# Altium schematic sheet Level_Shifter.SchDoc
size A4; CompanyName: Technische Hochschule Nürnberg Georg Simon Ohm; Organization: UltraZohm; Address1: Kesslerplatz 12; Address2: 90489 Nürnberg; Address3: GERMANY; DocumentNumber: 4; SheetNumber: 4; SheetTotal: 5; Website: www.ultrazohm.com
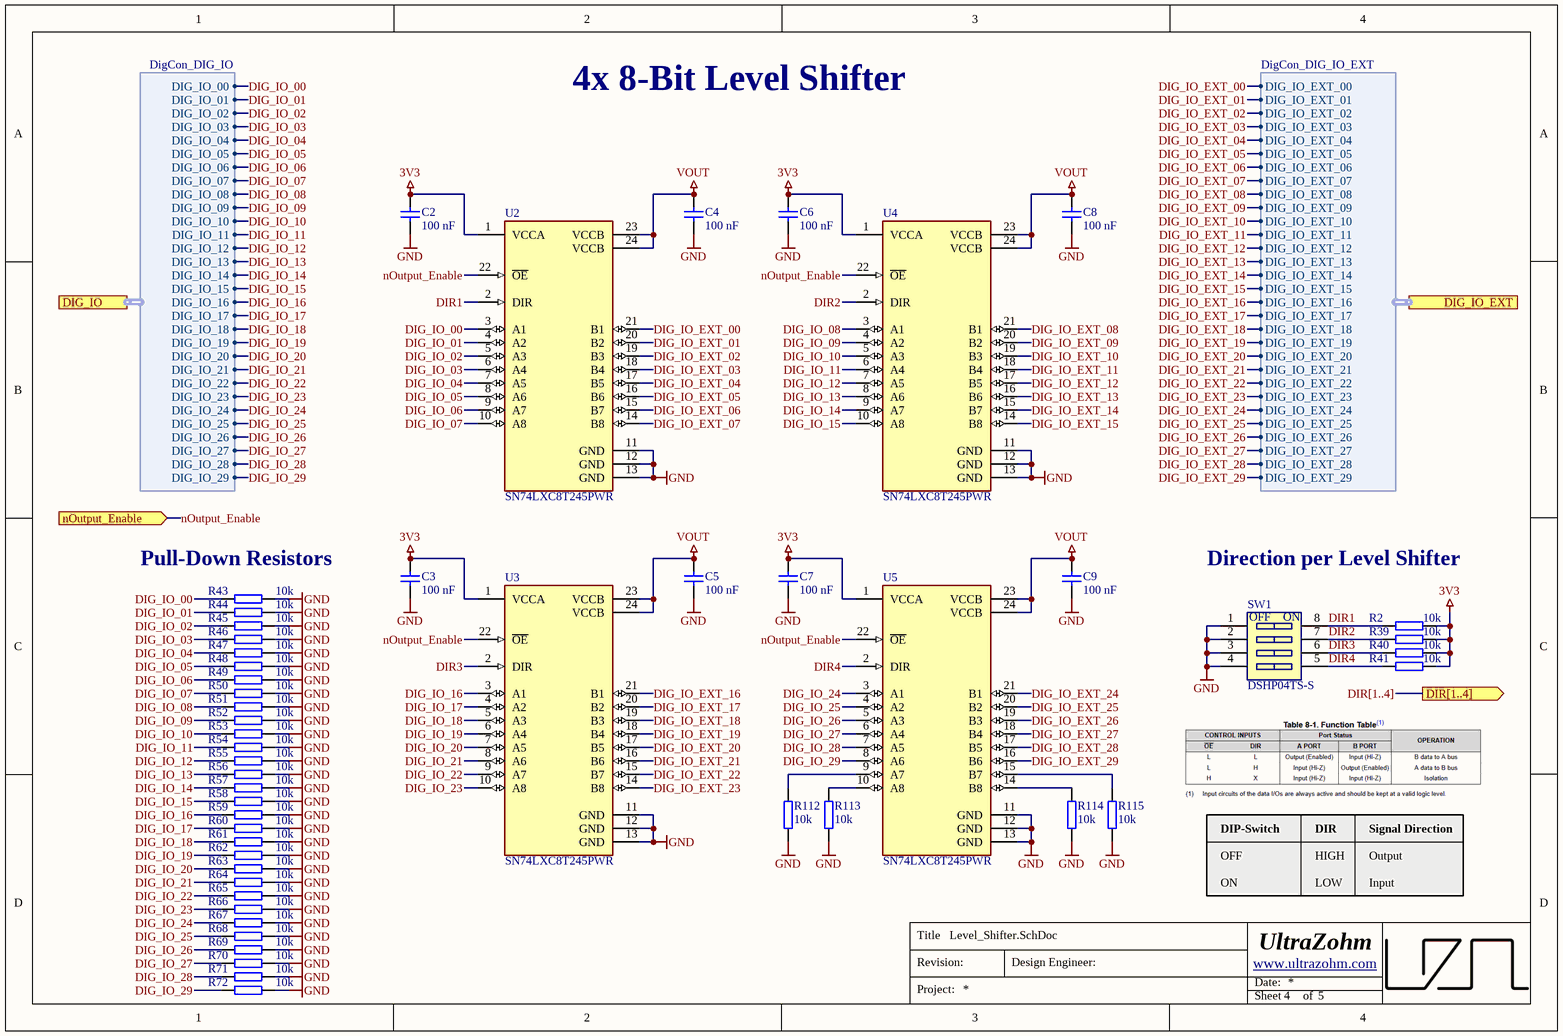
[diagram p0: Level_Shifter.SchDoc]

## Parts
C2  100 nF  [C_0603_TE]
C3  100 nF  [C_0603_TE]
C4  100 nF  [C_0603_TE]
C5  100 nF  [C_0603_TE]
C6  100 nF  [C_0603_TE]
C7  100 nF  [C_0603_TE]
C8  100 nF  [C_0603_TE]
C9  100 nF  [C_0603_TE]
R2  10k  [R_0603_TE]
R39  10k  [R_0603_TE]
R40  10k  [R_0603_TE]
R41  10k  [R_0603_TE]
R43  10k  [R_0603_TE]
R44  10k  [R_0603_TE]
R45  10k  [R_0603_TE]
R46  10k  [R_0603_TE]
R47  10k  [R_0603_TE]
R48  10k  [R_0603_TE]
R49  10k  [R_0603_TE]
R50  10k  [R_0603_TE]
R51  10k  [R_0603_TE]
R52  10k  [R_0603_TE]
R53  10k  [R_0603_TE]
R54  10k  [R_0603_TE]
R55  10k  [R_0603_TE]
R56  10k  [R_0603_TE]
R57  10k  [R_0603_TE]
R58  10k  [R_0603_TE]
R59  10k  [R_0603_TE]
R60  10k  [R_0603_TE]
R61  10k  [R_0603_TE]
R62  10k  [R_0603_TE]
R63  10k  [R_0603_TE]
R64  10k  [R_0603_TE]
R65  10k  [R_0603_TE]
R66  10k  [R_0603_TE]
R67  10k  [R_0603_TE]
R68  10k  [R_0603_TE]
R69  10k  [R_0603_TE]
R70  10k  [R_0603_TE]
R71  10k  [R_0603_TE]
R72  10k  [R_0603_TE]
R112  10k  [R_0603_TE]
R113  10k  [R_0603_TE]
R114  10k  [R_0603_TE]
R115  10k  [R_0603_TE]
SW1  DSHP04TS-S  [416131160804]
U2  SN74LXC8T245PWR  [TSSOP-24]
U3  SN74LXC8T245PWR  [TSSOP-24]
U4  SN74LXC8T245PWR  [TSSOP-24]
U5  SN74LXC8T245PWR  [TSSOP-24]

## Ports
DIG_IO (harness DigCon_DIG_IO), DIG_IO_EXT (harness DigCon_DIG_IO_EXT), DIR[1..4] (out), nOutput_Enable (in)

## Harnesses
DigCon_DIG_IO: DIG_IO_01, DIG_IO_02, DIG_IO_03, DIG_IO_04, DIG_IO_05, DIG_IO_06, DIG_IO_07, DIG_IO_08, DIG_IO_09, DIG_IO_10, DIG_IO_11, DIG_IO_12, DIG_IO_13, DIG_IO_14, DIG_IO_15, DIG_IO_16, DIG_IO_17, DIG_IO_18, DIG_IO_19, DIG_IO_20, DIG_IO_21, DIG_IO_22, DIG_IO_23, DIG_IO_24, DIG_IO_25, DIG_IO_26, DIG_IO_27, DIG_IO_28, DIG_IO_29, DIG_IO_00
DigCon_DIG_IO_EXT: DIG_IO_EXT_00, DIG_IO_EXT_01, DIG_IO_EXT_02, DIG_IO_EXT_03, DIG_IO_EXT_04, DIG_IO_EXT_05, DIG_IO_EXT_06, DIG_IO_EXT_07, DIG_IO_EXT_08, DIG_IO_EXT_09, DIG_IO_EXT_10, DIG_IO_EXT_11, DIG_IO_EXT_12, DIG_IO_EXT_13, DIG_IO_EXT_14, DIG_IO_EXT_15, DIG_IO_EXT_16, DIG_IO_EXT_17, DIG_IO_EXT_18, DIG_IO_EXT_19, DIG_IO_EXT_20, DIG_IO_EXT_21, DIG_IO_EXT_22, DIG_IO_EXT_23, DIG_IO_EXT_24, DIG_IO_EXT_25, DIG_IO_EXT_26, DIG_IO_EXT_27, DIG_IO_EXT_28, DIG_IO_EXT_29

## Nets
3V3: C2.1 C3.1 C6.1 C7.1 R2.2 R39.2 R40.2 R41.2 U2.1(VCCA) U3.1(VCCA) U4.1(VCCA) U5.1(VCCA)
GND: C2.2 C3.2 C4.2 C5.2 C6.2 C7.2 C8.2 C9.2 R43.2 R44.2 R45.2 R46.2 R47.2 R48.2 R49.2 R50.2 R51.2 R52.2 R53.2 R54.2 R55.2 R56.2 R57.2 R58.2 R59.2 R60.2 R61.2 R62.2 R63.2 R64.2 R65.2 R66.2 R67.2 R68.2 R69.2 R70.2 R71.2 R72.2 R112.1 R113.1 R114.1 R115.1 SW1.1 SW1.2 SW1.3 SW1.4 U2.11(GND) U2.12(GND) U2.13(GND) U3.11(GND) U3.12(GND) U3.13(GND) U4.11(GND) U4.12(GND) U4.13(GND) U5.11(GND) U5.12(GND) U5.13(GND)
VOUT: C4.1 C5.1 C8.1 C9.1 U2.23(VCCB) U2.24(VCCB) U3.23(VCCB) U3.24(VCCB) U4.23(VCCB) U4.24(VCCB) U5.23(VCCB) U5.24(VCCB)
DIG_IO_00: R43.1 U2.3(A1) ; port DIG_IO.DIG_IO_00
DIG_IO_01: R44.1 U2.4(A2) ; port DIG_IO.DIG_IO_01
DIG_IO_02: R45.1 U2.5(A3) ; port DIG_IO.DIG_IO_02
DIG_IO_03: R46.1 U2.6(A4) ; port DIG_IO.DIG_IO_03
DIG_IO_04: R47.1 U2.7(A5) ; port DIG_IO.DIG_IO_04
DIG_IO_05: R48.1 U2.8(A6) ; port DIG_IO.DIG_IO_05
DIG_IO_06: R49.1 U2.9(A7) ; port DIG_IO.DIG_IO_06
DIG_IO_07: R50.1 U2.10(A8) ; port DIG_IO.DIG_IO_07
DIG_IO_08: R51.1 U4.3(A1) ; port DIG_IO.DIG_IO_08
DIG_IO_09: R52.1 U4.4(A2) ; port DIG_IO.DIG_IO_09
DIG_IO_10: R53.1 U4.5(A3) ; port DIG_IO.DIG_IO_10
DIG_IO_11: R54.1 U4.6(A4) ; port DIG_IO.DIG_IO_11
DIG_IO_12: R55.1 U4.7(A5) ; port DIG_IO.DIG_IO_12
DIG_IO_13: R56.1 U4.8(A6) ; port DIG_IO.DIG_IO_13
DIG_IO_14: R57.1 U4.9(A7) ; port DIG_IO.DIG_IO_14
DIG_IO_15: R58.1 U4.10(A8) ; port DIG_IO.DIG_IO_15
DIG_IO_16: R59.1 U3.3(A1) ; port DIG_IO.DIG_IO_16
DIG_IO_17: R60.1 U3.4(A2) ; port DIG_IO.DIG_IO_17
DIG_IO_18: R61.1 U3.5(A3) ; port DIG_IO.DIG_IO_18
DIG_IO_19: R62.1 U3.6(A4) ; port DIG_IO.DIG_IO_19
DIG_IO_20: R63.1 U3.7(A5) ; port DIG_IO.DIG_IO_20
DIG_IO_21: R64.1 U3.8(A6) ; port DIG_IO.DIG_IO_21
DIG_IO_22: R65.1 U3.9(A7) ; port DIG_IO.DIG_IO_22
DIG_IO_23: R66.1 U3.10(A8) ; port DIG_IO.DIG_IO_23
DIG_IO_24: R67.1 U5.3(A1) ; port DIG_IO.DIG_IO_24
DIG_IO_25: R68.1 U5.4(A2) ; port DIG_IO.DIG_IO_25
DIG_IO_26: R69.1 U5.5(A3) ; port DIG_IO.DIG_IO_26
DIG_IO_27: R70.1 U5.6(A4) ; port DIG_IO.DIG_IO_27
DIG_IO_28: R71.1 U5.7(A5) ; port DIG_IO.DIG_IO_28
DIG_IO_29: R72.1 U5.8(A6) ; port DIG_IO.DIG_IO_29
DIG_IO_EXT_00: U2.21(B1) ; port DIG_IO_EXT.DIG_IO_EXT_00
DIG_IO_EXT_01: U2.20(B2) ; port DIG_IO_EXT.DIG_IO_EXT_01
DIG_IO_EXT_02: U2.19(B3) ; port DIG_IO_EXT.DIG_IO_EXT_02
DIG_IO_EXT_03: U2.18(B4) ; port DIG_IO_EXT.DIG_IO_EXT_03
DIG_IO_EXT_04: U2.17(B5) ; port DIG_IO_EXT.DIG_IO_EXT_04
DIG_IO_EXT_05: U2.16(B6) ; port DIG_IO_EXT.DIG_IO_EXT_05
DIG_IO_EXT_06: U2.15(B7) ; port DIG_IO_EXT.DIG_IO_EXT_06
DIG_IO_EXT_07: U2.14(B8) ; port DIG_IO_EXT.DIG_IO_EXT_07
DIG_IO_EXT_08: U4.21(B1) ; port DIG_IO_EXT.DIG_IO_EXT_08
DIG_IO_EXT_09: U4.20(B2) ; port DIG_IO_EXT.DIG_IO_EXT_09
DIG_IO_EXT_10: U4.19(B3) ; port DIG_IO_EXT.DIG_IO_EXT_10
DIG_IO_EXT_11: U4.18(B4) ; port DIG_IO_EXT.DIG_IO_EXT_11
DIG_IO_EXT_12: U4.17(B5) ; port DIG_IO_EXT.DIG_IO_EXT_12
DIG_IO_EXT_13: U4.16(B6) ; port DIG_IO_EXT.DIG_IO_EXT_13
DIG_IO_EXT_14: U4.15(B7) ; port DIG_IO_EXT.DIG_IO_EXT_14
DIG_IO_EXT_15: U4.14(B8) ; port DIG_IO_EXT.DIG_IO_EXT_15
DIG_IO_EXT_16: U3.21(B1) ; port DIG_IO_EXT.DIG_IO_EXT_16
DIG_IO_EXT_17: U3.20(B2) ; port DIG_IO_EXT.DIG_IO_EXT_17
DIG_IO_EXT_18: U3.19(B3) ; port DIG_IO_EXT.DIG_IO_EXT_18
DIG_IO_EXT_19: U3.18(B4) ; port DIG_IO_EXT.DIG_IO_EXT_19
DIG_IO_EXT_20: U3.17(B5) ; port DIG_IO_EXT.DIG_IO_EXT_20
DIG_IO_EXT_21: U3.16(B6) ; port DIG_IO_EXT.DIG_IO_EXT_21
DIG_IO_EXT_22: U3.15(B7) ; port DIG_IO_EXT.DIG_IO_EXT_22
DIG_IO_EXT_23: U3.14(B8) ; port DIG_IO_EXT.DIG_IO_EXT_23
DIG_IO_EXT_24: U5.21(B1) ; port DIG_IO_EXT.DIG_IO_EXT_24
DIG_IO_EXT_25: U5.20(B2) ; port DIG_IO_EXT.DIG_IO_EXT_25
DIG_IO_EXT_26: U5.19(B3) ; port DIG_IO_EXT.DIG_IO_EXT_26
DIG_IO_EXT_27: U5.18(B4) ; port DIG_IO_EXT.DIG_IO_EXT_27
DIG_IO_EXT_28: U5.17(B5) ; port DIG_IO_EXT.DIG_IO_EXT_28
DIG_IO_EXT_29: U5.16(B6) ; port DIG_IO_EXT.DIG_IO_EXT_29
DIR1: R2.1 SW1.8 U2.2(DIR)
DIR2: R39.1 SW1.7 U4.2(DIR)
DIR3: R40.1 SW1.6 U3.2(DIR)
DIR4: R41.1 SW1.5 U5.2(DIR)
nOutput_Enable: U2.22(~{OE}) U3.22(~{OE}) U4.22(~{OE}) U5.22(~{OE}) ; port nOutput_Enable
NetR112_2: R112.2 U5.9(A7)
NetR113_2: R113.2 U5.10(A8)
NetR114_2: R114.2 U5.14(B8)
NetR115_2: R115.2 U5.15(B7)

## Buses and harness runs
bus DIR[1..4] = port DIR[1..4]

## Notes on the sheet
- 4x 8-Bit Level Shifter
- Pull-Down Resistors
- Direction per Level Shifter
- DIP-Switch
- OFF
- DIR
- HIGH
- Signal Direction
- Output
- ON
- LOW
- Input
- Title
- Revision:
- Design Engineer:
- Date:
- Project:
- Sheet
- of
- (in symbol DSHP04TS-S) OFF; ON

## Library data of the parts
C2-C9 = UZgen_C_0603_100nF_50V_X7R: Generic capacitor; Manufacturer: UZgen; Voltage: 50V; Tolerance: 10 %; Created from: AGeiger; Manufacturer Part Number: UZgen_C_0603_100nF_50V_X7R; PartID: 1; Created On: 02.07.2024 14:42:23; Value: 100 nF; Device Package: 0603; Technology: X7R; Mounting Type: SMD; Last Updated: 08.08.2024 15:01:15
R2 R39-R41 R43-R72 R112-R115 = UZgen_R_0603_10k: Generic resistor; Manufacturer: UZgen; Tolerance: 1 %; Created from: AGeiger; Manufacturer Part Number: UZgen_R_0603_10k; PartID: 1; Created On: 02.07.2024 14:34:53; Value: 10k; Device Package: 0603; Mounting Type: SMD; Last Updated: 02.07.2024 14:37:16
SW1 = DSHP04TS-S: 04p, 1.27mm Pitch, Horizontal, HP Type, SMT, flat Actuator, black, with Tape, T&R; Manufacturer: XKB Connectivity; Value: DIP-Switch; Created from: T. Wendt; Manufacturer Part Number: DSHP04TS-S; PartID: 6; Created On: 02.03.2021 14:59:37; ComponentLink1Description: Datasheet; ComponentLink1URL: https://www.lcsc.com/datasheet/lcsc_datasheet_2110151630_XKB-Connection-DSHP04TS-S_C319050.pdf; Component Type: DIP-Switch; Device Package: DIP; Last Updated: 20.12.2024 15:31:19; Minimum Order: 1; Mounting Type: SMD; Supplier 1: LCSC; Supplier Part Number 1: C319050; Type: DIP-Switch; Live Cycle Status: 1; LCSC Part Number: C319050; Stock number: not stored
U2-U5 = SN74LXC8T245PWR: 8-bit Dual-Supply Bus Transceiver with Configurable Level Shifting and 3-State Outputs; Manufacturer: Texas Instruments; Value: 1.1 - 5.5 V; Created from: AGeiger; ComponentLink2Description: Datasheet; ComponentLink2URL: http://www.ti.com/lit/ds/symlink/sn74lvc8t245.pdf; Manufacturer Part Number: SN74LXC8T245PWR; PartID: 12; Created On: 13.12.2024 11:01:59; ComponentLink1Description: Datasheet; ComponentLink1URL: https://www.ti.com/lit/ds/symlink/sn74lxc8t245.pdf; Component Type: Level Shifter; Device Package: TSSOP-24; Last Updated: 20.12.2024 10:32:15; Mounting Type: SMD; Operating Temperature: –40 to +125 °C; Series: SN74LXC8T245; Supplier 1: Mouser; Supplier Part Number 1: 595-SN74LXC8T245PWR; Supplier 2: LCSC; Supplier Part Number 2: C4363995; Type: Level Shifter; Live Cycle Status: 1; Stock number: not stored; LCSC Part Number: C4363995